# EAGLE design CBAM3.5 (EAGLE 5.07)
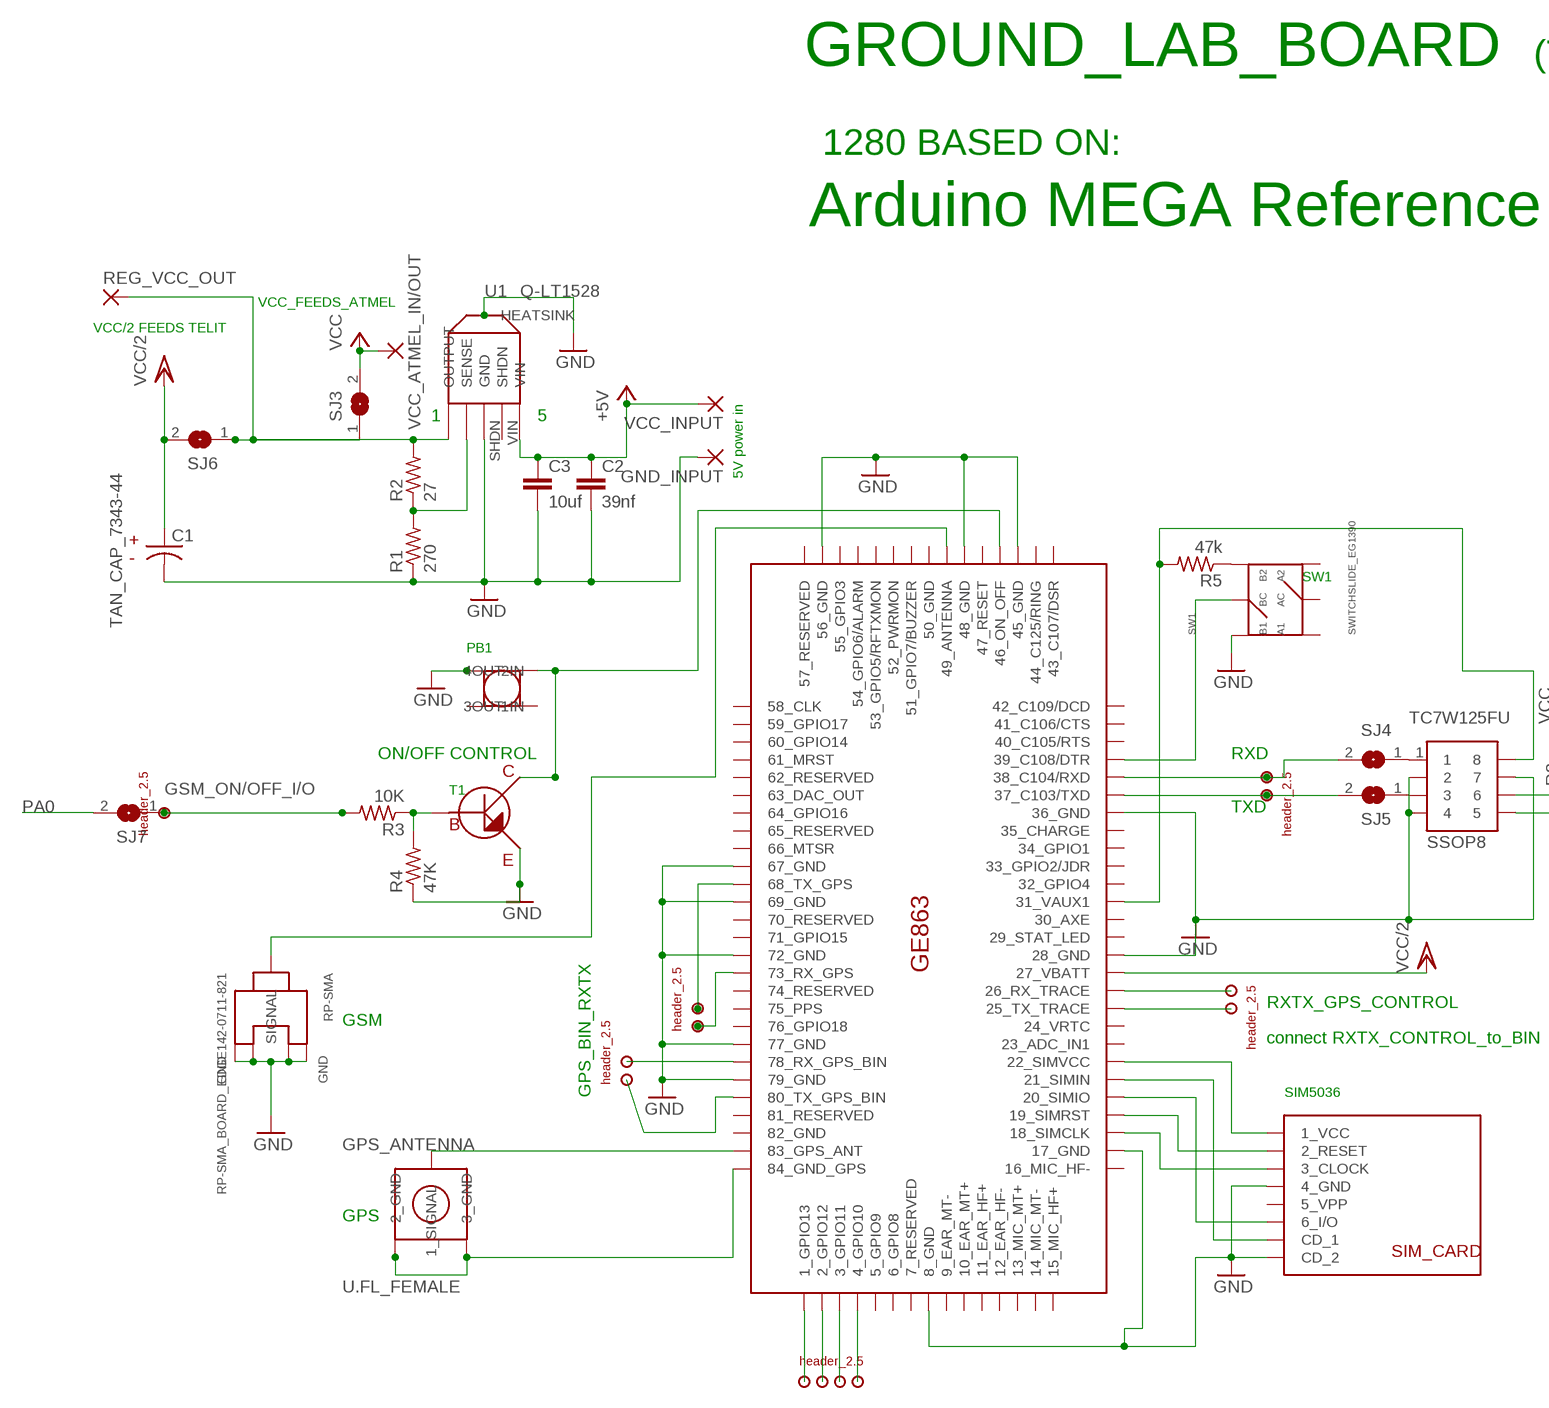
[diagram p0: schematic, sheet 1, part 1 of 2]
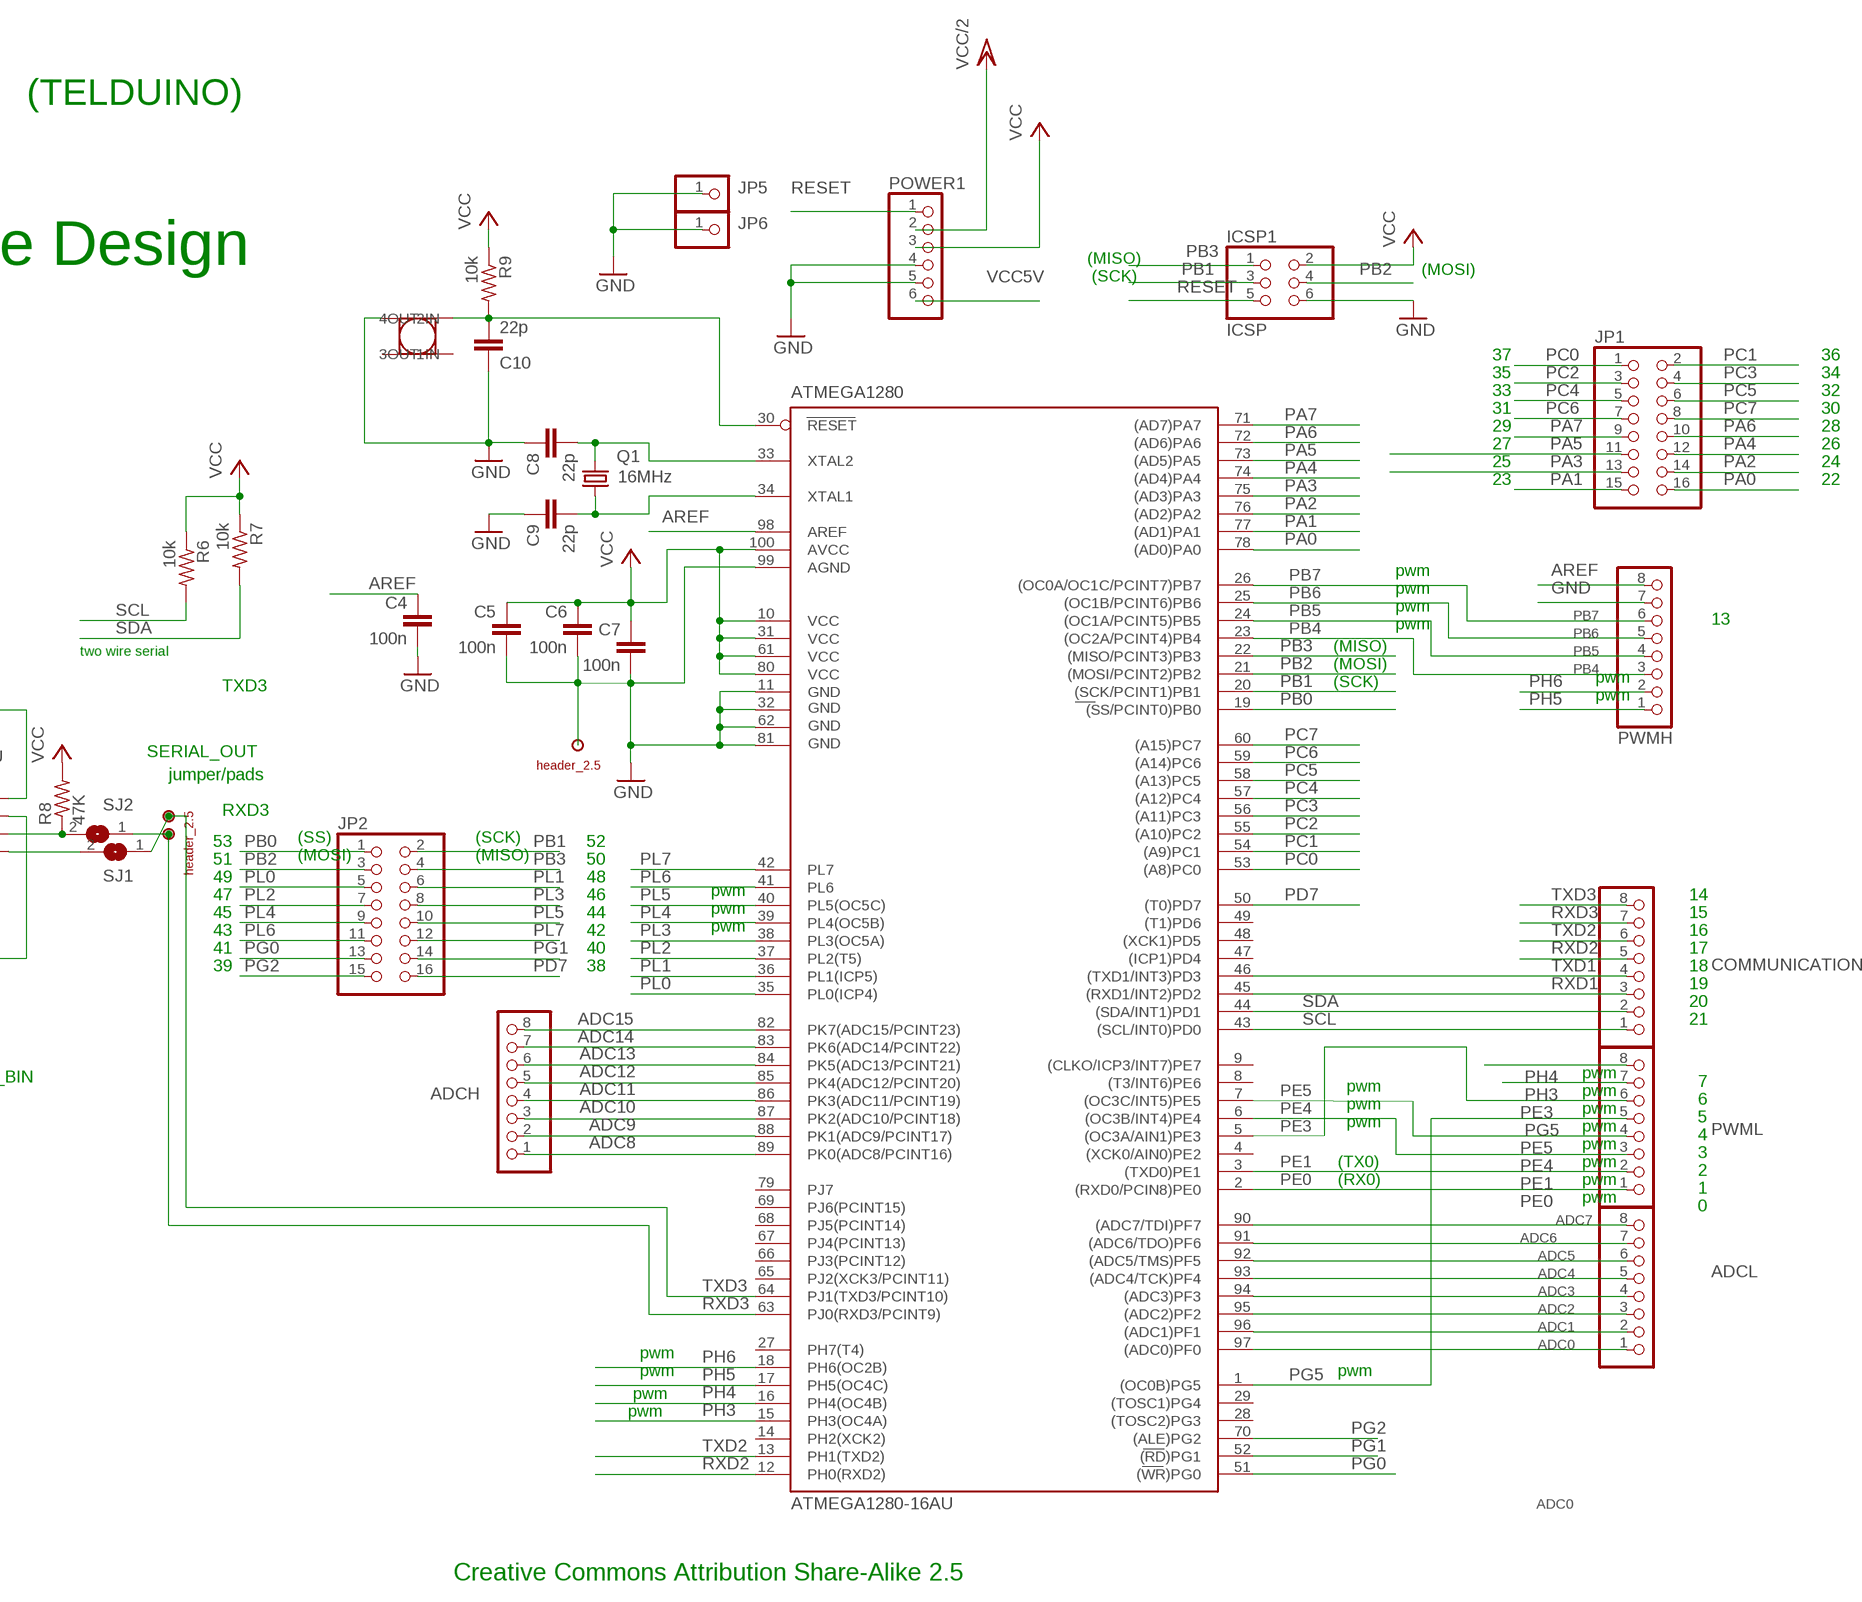
[diagram p1: schematic, sheet 1, part 2 of 2]

## Parts
ADCH  PINHD-1X8  [1X08]
ADCL  PINHD-1X8  [1X08]
AGND  2.5_1HEADER  [2.5_1HEADER]
ATMEGA1280  ATMEGA1280-16AU  [TQFP100]
C1  TAN_CAP_7343-44  [TAN_CAP_7343-44]
C2  39nf  C-EUC0805  [C0805]
C3  10uf  C-EUC1206  [C1206]
C4  100n  C-EUC0805  [C0805]
C5  100n  C-EUC0805  [C0805]
C6  100n  C-EUC0805  [C0805]
C7  100n  C-EUC0805  [C0805]
C8  22p  C-EUC0805  [C0805]
C9  22p  C-EUC0805  [C0805]
C10  22p  C-EUC0805  [C0805]
COMMUNICATION  PINHD-1X8  [1X08]
GE863  GE836  [GE836]
GND_INPUT  3,81/1,4  [3,81/1,4]
GPS_ANTENNA  U.FL_FEMALE  [U.FL_FEMALE]
ICSP1  ICSP  PINHD-2X3  [2X03]
JP1  PINHD-2X8  [2X08]
JP2  PINHD-2X8  [2X08]
JP5  PINHD-1X1  [1X01]
JP6  PINHD-1X1  [1X01]
POWER  SWITCHPB_KPT-1187B  [SWITCHPB_KPT-1187B]
POWER1  PINHD-1X6  [1X06]
POWER2  SWITCHPB_KPT-1187B  [SWITCHPB_KPT-1187B]
PWMH  PINHD-1X8  [1X08]
PWML  PINHD-1X8  [1X08]
Q1  16MHz  CRYTALHC49S  [HC49/S]
R1  270  R-US_0207/10  [0207/10]
R2  27  R-US_0207/10  [0207/10]
R3  10K  R-US_R1206  [R1206]
R4  47K  R-US_R1206  [R1206]
R5  47k  R-US_R1206  [R1206]
R6  10k  R-US_R1206  [R1206]
R7  10k  R-US_R1206  [R1206]
R8  47K  R-US_0207/10  [0207/10]
R9  10k  R-US_R1206  [R1206]
REG_VCC_OUT  3,81/1,4  [3,81/1,4]
RP-SMA  RP-SMA_BOARD_EDGE142-0711-821  [RP-SMA_SMALL]
RX/TX_ATMEL  2.5_2HEADER  [2.5_2HEADER]
RX/TX_GPS  2.5_2HEADER  [2.5_2HEADER]
RX/TX_GPS_BIN  2.5_2HEADER  [2.5_2HEADER]
RX/TX_TELIT  2.5_2HEADER  [2.5_2HEADER]
RX/TX_TRACE  2.5_2HEADER  [2.5_2HEADER]
SIM5036  SIMCARD_5036  [SIMCARD_5036]
SJ1  SJ  [SJ]
SJ2  SJ  [SJ]
SJ3  SJW  [SJW]
SJ4  SJ  [SJ]
SJ5  SJ  [SJ]
SJ6  SJW  [SJW]
SJ7  SJ  [SJ]
SW1  SWITCHSLIDE_EG1390  [SWITCHSLIDE_EG1390]
T1  SOT-23_MMBT4403  [SOT-23_MMBT4403]
TC7W125FU  SSOP8  [SSOP8]
TELIT_I/O_PINS  2.5_4HEADER  [2.5_4HEADER]
TELIT_ON/OFF  2.5_1HEADER  [2.5_1HEADER]
U1  Q-LT1528  [Q-LT1528]
VCC_ATMEL_IN/OUT  3,81/1,4  [3,81/1,4]
VCC_INPUT  3,81/1,4  [3,81/1,4]

## Nets
1_GPIO: GE863.1_GPIO13 TELIT_I/O_PINS.P$1(H1)
2_GPIO: GE863.2_GPIO12 TELIT_I/O_PINS.P$2(H2)
3_GPIO: GE863.3_GPIO11 TELIT_I/O_PINS.P$3(H3)
4_GPIO: GE863.4_GPIO10 TELIT_I/O_PINS.P$4(H4)
25_TX_TRACE: GE863.25_TX_TRACE RX/TX_TRACE.P$2(H2)
26_RX_TRACE: GE863.26_RX_TRACE RX/TX_TRACE.P$1(H1)
31_VAUX: GE863.31_VAUX1 R5.2 TC7W125FU.8
68_TXGPS: GE863.68_TX_GPS RX/TX_GPS.P$2(H2)
73_RXGPS: GE863.73_RX_GPS RX/TX_GPS.P$1(H1)
78_RX_GPS_BIN: GE863.78_RX_GPS_BIN RX/TX_GPS_BIN.P$2(H2)
80_TX_GPS_BIN: GE863.80_TX_GPS_BIN RX/TX_GPS_BIN.P$1(H1)
83_GPS_ANT: GE863.83_GPS_ANT GPS_ANTENNA.SIGNAL(1_SIGNAL)
84_GND_GPS: GE863.84_GND_GPS GPS_ANTENNA.GND1(2_GND) GPS_ANTENNA.GND2(3_GND)
ADC0: ADCL.1 ATMEGA1280.97((ADC0)PF0)
ADC1: ADCL.2 ATMEGA1280.96((ADC1)PF1)
ADC2: ADCL.3 ATMEGA1280.95((ADC2)PF2)
ADC3: ADCL.4 ATMEGA1280.94((ADC3)PF3)
ADC4: ADCL.5 ATMEGA1280.93((ADC4/TCK)PF4)
ADC5: ADCL.6 ATMEGA1280.92((ADC5/TMS)PF5)
ADC6: ADCL.7 ATMEGA1280.91((ADC6/TDO)PF6)
ADC7: ADCL.8 ATMEGA1280.90((ADC7/TDI)PF7)
ADC8: ADCH.1 ATMEGA1280.89(PK0(ADC8/PCINT16))
ADC9: ADCH.2 ATMEGA1280.88(PK1(ADC9/PCINT17))
ADC10: ADCH.3 ATMEGA1280.87(PK2(ADC10/PCINT18))
ADC11: ADCH.4 ATMEGA1280.86(PK3(ADC11/PCINT19))
ADC12: ADCH.5 ATMEGA1280.85(PK4(ADC12/PCINT20))
ADC13: ADCH.6 ATMEGA1280.84(PK5(ADC13/PCINT21))
ADC14: ADCH.7 ATMEGA1280.83(PK6(ADC14/PCINT22))
ADC15: ADCH.8 ATMEGA1280.82(PK7(ADC15/PCINT23))
AREF: ATMEGA1280.98(AREF) C4.1 PWMH.8
DTR: GE863.39_C108/DTR SW1.BCOM
GND [gnd]: AGND.P$1(H1) ATMEGA1280.11(GND) ATMEGA1280.32(GND1) ATMEGA1280.62(GND2) ATMEGA1280.81(GND3) ATMEGA1280.99(AGND) C1.NEG C2.2 C3.2 C4.2 C5.2 C6.2 C7.2 C8.1 C9.1 C10.1 GE863.8_GND GE863.17_GND GE863.28_GND GE863.36_GND GE863.45_GND GE863.48_GND GE863.56_GND GE863.67_GND GE863.69_GND GE863.72_GND GE863.77_GND GE863.79_GND GND_INPUT.1(P) ICSP1.6 JP5.1 JP6.1 POWER1.4 POWER1.5 POWER2.2IN POWER.2IN PWMH.7 R1.1 R4.1 RP-SMA.P$1(1GND) RP-SMA.P$2(2GND) RP-SMA.P$3(3GND) RP-SMA.P$4(4GND) SIM5036.4_GND SIM5036.CD_2 SW1.B1 T1.E TC7W125FU.2 TC7W125FU.4 TC7W125FU.7 U1.GND U1.HEATSINK
GSM_ON/OFF_I/O: R3.2 SJ7.1 TELIT_ON/OFF.P$1(H1)
N$1: R8.1 SJ2.2 TC7W125FU.6
N$2 [aSignal]: GE863.49_ANTENNA RP-SMA.SIGNAL
N$3: SJ5.1 TC7W125FU.3
N$4: R5.1 SW1.B2
N$5: SJ4.1 TC7W125FU.1
N$6: ATMEGA1280.34(XTAL1) C9.2 Q1.1
N$7: ATMEGA1280.33(XTAL2) C8.2 Q1.2
N$53: R3.1 R4.2 T1.B
ON/OFF: GE863.46_ON_OFF POWER.4OUT T1.C
PA0: ATMEGA1280.78((AD0)PA0) JP1.16 SJ7.2
PA1: ATMEGA1280.77((AD1)PA1) JP1.15
PA2: ATMEGA1280.76((AD2)PA2) JP1.14
PA3: ATMEGA1280.75((AD3)PA3) JP1.13
PA4: ATMEGA1280.74((AD4)PA4) JP1.12
PA5: ATMEGA1280.73((AD5)PA5) JP1.11
PA6: ATMEGA1280.72((AD6)PA6) JP1.10
PA7: ATMEGA1280.71((AD7)PA7) JP1.9
PB0: ATMEGA1280.19((SS/PCINT0)PB0) JP2.1
PB1: ATMEGA1280.20((SCK/PCINT1)PB1) ICSP1.3 JP2.2
PB2: ATMEGA1280.21((MOSI/PCINT2)PB2) ICSP1.4 JP2.3
PB3: ATMEGA1280.22((MISO/PCINT3)PB3) ICSP1.1 JP2.4
PB4: ATMEGA1280.23((OC2A/PCINT4)PB4) PWMH.3
PB5: ATMEGA1280.24((OC1A/PCINT5)PB5) PWMH.4
PB6: ATMEGA1280.25((OC1B/PCINT6)PB6) PWMH.5
PB7: ATMEGA1280.26((OC0A/OC1C/PCINT7)PB7) PWMH.6
PC0: ATMEGA1280.53((A8)PC0) JP1.1
PC1: ATMEGA1280.54((A9)PC1) JP1.2
PC2: ATMEGA1280.55((A10)PC2) JP1.3
PC3: ATMEGA1280.56((A11)PC3) JP1.4
PC4: ATMEGA1280.57((A12)PC4) JP1.5
PC5: ATMEGA1280.58((A13)PC5) JP1.6
PC6: ATMEGA1280.59((A14)PC6) JP1.7
PC7: ATMEGA1280.60((A15)PC7) JP1.8
PD7: ATMEGA1280.50((T0)PD7) JP2.16
PE0: ATMEGA1280.2((RXD0/PCIN8)PE0) PWML.1
PE1: ATMEGA1280.3((TXD0)PE1) PWML.2
PE3: ATMEGA1280.5((OC3A/AIN1)PE3) PWML.6
PE4: ATMEGA1280.6((OC3B/INT4)PE4) PWML.3
PE5: ATMEGA1280.7((OC3C/INT5)PE5) PWML.4
PG0: ATMEGA1280.51((WR)PG0) JP2.13
PG1: ATMEGA1280.52((RD)PG1) JP2.14
PG2: ATMEGA1280.70((ALE)PG2) JP2.15
PG5: ATMEGA1280.1((OC0B)PG5) PWML.5
PH3: ATMEGA1280.15(PH3(OC4A)) PWML.7
PH4: ATMEGA1280.16(PH4(OC4B)) PWML.8
PH5: ATMEGA1280.17(PH5(OC4C)) PWMH.1
PH6: ATMEGA1280.18(PH6(OC2B)) PWMH.2
PL0: ATMEGA1280.35(PL0(ICP4)) JP2.5
PL1: ATMEGA1280.36(PL1(ICP5)) JP2.6
PL2: ATMEGA1280.37(PL2(T5)) JP2.7
PL3: ATMEGA1280.38(PL3(OC5A)) JP2.8
PL4: ATMEGA1280.39(PL4(OC5B)) JP2.9
PL5: ATMEGA1280.40(PL5(OC5C)) JP2.10
PL6: ATMEGA1280.41(PL6) JP2.11
PL7: ATMEGA1280.42(PL7) JP2.12
REG_OUTPUT [power]: R2.2 REG_VCC_OUT.1(P) SJ3.1 SJ6.1 U1.OUTPUT
RESET: ATMEGA1280.30(RESET) C10.2 ICSP1.5 POWER1.1 POWER2.4OUT R9.2
RXD: GE863.38_C104/RXD RX/TX_TELIT.P$1(H1) SJ4.2
RXD1: ATMEGA1280.45((RXD1/INT2)PD2) COMMUNICATION.3
RXD2: ATMEGA1280.12(PH0(RXD2)) COMMUNICATION.5
RXD3: ATMEGA1280.63(PJ0(RXD3/PCINT9)) COMMUNICATION.7 RX/TX_ATMEL.P$2(H2) SJ2.1
SCL: ATMEGA1280.43((SCL/INT0)PD0) COMMUNICATION.1 R6.2
SDA: ATMEGA1280.44((SDA/INT1)PD1) COMMUNICATION.2 R7.2
SENCE: R1.2 R2.1 U1.SENCE(SENSE)
SIMCLOCK: GE863.18_SIMCLK SIM5036.3_CLOCK
SIMIN: GE863.21_SIMIN SIM5036.CD_1
SIMIO: GE863.20_SIMIO SIM5036.6_I/O
SIMRESET: GE863.19_SIMRST SIM5036.2_RESET
SIMVCC: GE863.22_SIMVCC SIM5036.1_VCC
TXD: GE863.37_C103/TXD RX/TX_TELIT.P$2(H2) SJ5.2
TXD1: ATMEGA1280.46((TXD1/INT3)PD3) COMMUNICATION.4
TXD2: ATMEGA1280.13(PH1(TXD2)) COMMUNICATION.6
TXD3: ATMEGA1280.64(PJ1(TXD3/PCINT10)) COMMUNICATION.8 RX/TX_ATMEL.P$1(H1) SJ1.1
TXD_IN: SJ1.2 TC7W125FU.5
VCC [VCC]: ATMEGA1280.10(VCC) ATMEGA1280.31(VCC1) ATMEGA1280.61(VCC2) ATMEGA1280.80(VCC3) ATMEGA1280.100(AVCC) C5.1 C6.1 C7.1 ICSP1.2 POWER1.3 R6.1 R7.1 R8.2 R9.1 SJ3.2 VCC_ATMEL_IN/OUT.1(P)
VCC5V [power]: C2.1 C3.1 POWER1.6 U1.VIN VCC_INPUT.1(P) ; supply symbol labelled +5V
VCC/2 [power]: C1.POS GE863.27_VBATT POWER1.2 SJ6.2
Unconnected: ATMEGA1280.4((XCK0/AIN0)PE2) ATMEGA1280.8((T3/INT6)PE6) ATMEGA1280.9((CLKO/ICP3/INT7)PE7) ATMEGA1280.14(PH2(XCK2)) ATMEGA1280.27(PH7(T4)) ATMEGA1280.28((TOSC2)PG3) ATMEGA1280.29((TOSC1)PG4) ATMEGA1280.47((ICP1)PD4) ATMEGA1280.48((XCK1)PD5) ATMEGA1280.49((T1)PD6) ATMEGA1280.65(PJ2(XCK3/PCINT11)) ATMEGA1280.66(PJ3(PCINT12)) ATMEGA1280.67(PJ4(PCINT13)) ATMEGA1280.68(PJ5(PCINT14)) ATMEGA1280.69(PJ6(PCINT15)) ATMEGA1280.79(PJ7) GE863.5_GPIO9 GE863.6_GPIO8 GE863.7_RESERVED GE863.9_EAR_MT- GE863.10_EAR_MT+ GE863.11_EAR_HF+ GE863.12_EAR_HF- GE863.13_MIC_MT+ GE863.14_MIC_MT- GE863.15_MIC_HF+ GE863.16_MIC_HF- GE863.23_ADC_IN1 GE863.24_VRTC GE863.29_STAT_LED GE863.30_AXE GE863.32_GPIO4 GE863.33_GPIO2/JDR GE863.34_GPIO1 GE863.35_CHARGE GE863.40_C105/RTS GE863.41_C106/CTS GE863.42_C109/DCD GE863.43_C107/DSR GE863.44_C125/RING GE863.47_RESET GE863.50_GND GE863.51_GPIO7/BUZZER GE863.52_PWRMON GE863.53_GPIO5/RFTXMON GE863.54_GPIO6/ALARM GE863.55_GPIO3 GE863.57_RESERVED GE863.58_CLK GE863.59_GPIO17 GE863.60_GPIO14 GE863.61_MRST GE863.62_RESERVED GE863.63_DAC_OUT GE863.64_GPIO16 GE863.65_RESERVED GE863.66_MTSR GE863.70_RESERVED GE863.71_GPIO15 GE863.74_RESERVED GE863.75_PPS GE863.76_GPIO18 GE863.81_RESERVED GE863.82_GND POWER2.1IN POWER2.3OUT POWER.1IN POWER.3OUT SIM5036.5_VPP SW1.A1 SW1.A2 SW1.ACOM U1.SHDN

## Notes on the sheet
- GROUND_LAB_BOARD | (TELDUINO)
- 1280 BASED ON:
- Arduino MEGA Reference Design | (MISO)
- (MOSI)
- (SCK)
- VCC_FEEDS_ATMEL
- 37 | 36
- VCC/2 FEEDS TELIT
- 35 | 34
- 33 | 32
- 31 | 30
- 29 | 28
- 5V power in
- 27 | 26
- 1 | 5
- 25 | 24
- 23 | 22
- pwm
- pwm
- pwm
- SW1
- pwm | 13
- (MISO)
- two wire serial
- (MOSI)
- (SCK) | pwm
- PB1 | TXD3
- pwm
- SERIAL_OUT
- jumper/pads
- ON/OFF CONTROL | RXD
- RXD3
- T1
- 53 | (SS) | (SCK) | 52
- TXD
- 51 | (MOSI) | (MISO) | 50
- 49 | 48
- 47 | 46 | pwm | 14
- 45 | 44 | pwm | 15
- 43 | 42 | pwm | 16
- 41 | 40 | 17
- 39 | 38 | 18
- 19
- 20
- 21
- RXTX_GPS_CONTROL
- GSM
- connect RXTX_CONTROL_to_BIN | pwm
- pwm | 7
- pwm
- pwm | 6
- pwm
- pwm | 5
- GPS_BIN_RXTX | pwm
- SIM5036
- 4
- pwm
- 3
- (TX0) | pwm
- 2
- (RX0) | pwm
- 1
- pwm
- 0
- GPS
- pwm
- pwm | pwm
- pwm
- pwm
- Creative Commons Attribution Share-Alike 2.5

## Library data of the parts
ADCH ADCL COMMUNICATION PWMH PWML = pinhead:PINHD-1X8: PIN HEADER
AGND TELIT_ON/OFF = myHeaders:2.5_1HEADER
ATMEGA1280 = atmel-2005:ATMEGA*: MICROCONTROLLER 64/128/256 Kbytes FLASH 4 Kbytes EEPROM 8 Kbytes SRAM 86 General Purpose I/O pins 12-channels16-bit PWM 4 x Serial USARTs 16-channels 10-bit A/D
C1 = myLib:TAN_CAP_7343-44
C2-C10 = rcl:C-EU: CAPACITOR, European symbol
GE863 = myLib:GE836
GND_INPUT REG_VCC_OUT VCC_ATMEL_IN/OUT VCC_INPUT = wirepad:3,81/1,4: THROUGH-HOLE PAD
GPS_ANTENNA = myLib:U.FL_FEMALE: tyco electronics 1566230 UMCC Female
ICSP1 = pinhead:PINHD-2X3: PIN HEADER
JP1 JP2 = pinhead:PINHD-2X8: PIN HEADER
JP5 JP6 = pinhead:PINHD-1X1: PIN HEADER
POWER POWER2 = myLib:SWITCHPB_KPT-1187B
POWER1 = pinhead:PINHD-1X6: PIN HEADER
Q1 = crystal:CRYTAL: CRYSTAL
R1-R9 = rcl:R-US_: RESISTOR, American symbol
RP-SMA = myConnectors:RP-SMA_BOARD_EDGE: RP-SMA board edge male connector man part # 142-4701-801 or #132255RP
RX/TX_ATMEL RX/TX_GPS RX/TX_GPS_BIN RX/TX_TELIT RX/TX_TRACE = myHeaders:2.5_2HEADER
SIM5036 = myLib:SIMCARD_5036
SJ1-SJ7 = jumper:SJ: SMD solder JUMPER
SW1 = myLib:SWITCHSLIDE_EG1390
T1 = mytransistors:SOT-23_MMBT4403
TC7W125FU = myIC:SSOP8: ssop8 package
TELIT_I/O_PINS = myHeaders:2.5_4HEADER: 2.5mm header spacing 1mm holes
U1 = myPowerRegulators:Q-LT1528: Q package for the LT1528 power Regulator, the heatsink connects to GND

## Net classes
0 default: width 0.203 mm, drill 0.406 mm, clearance 0.203 mm
1 power: width 0.61 mm, drill 0.711 mm, clearance 0.203 mm
2 gnd: width 0.305 mm, drill 0.711 mm, clearance 0.203 mm
3 VCC: width 0.508 mm, drill 0.711 mm, clearance 0.203 mm
4 aSignal: width 0.305 mm, drill 0.711 mm, clearance 0.508 mm

## Board
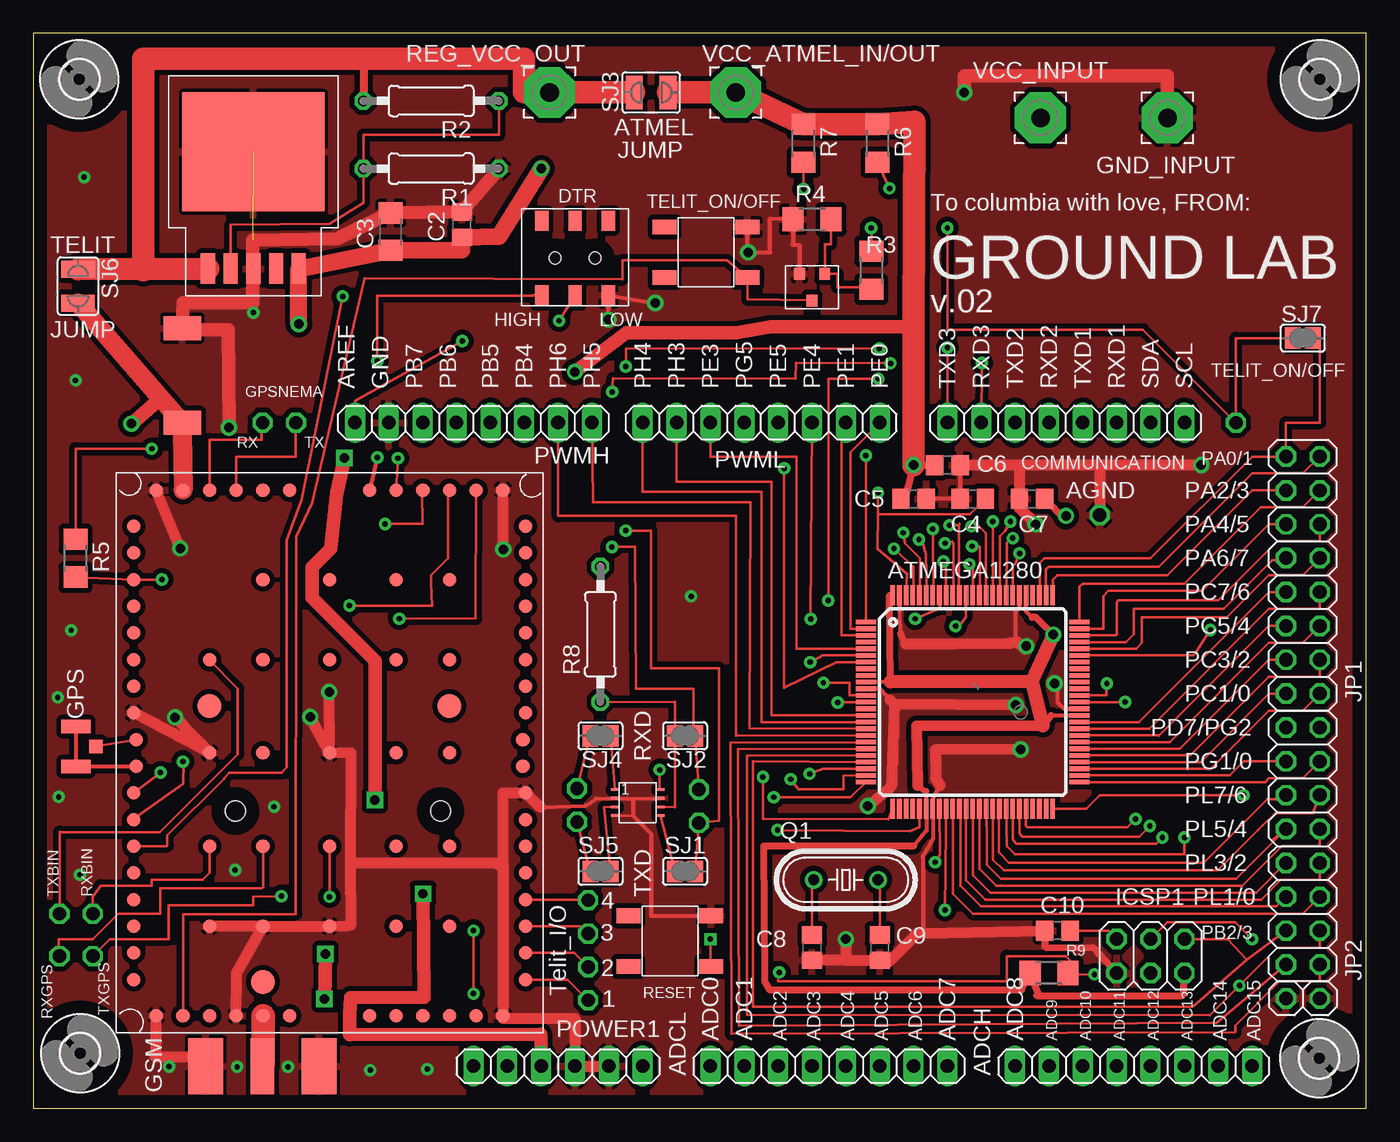
[diagram p2: board, top side]
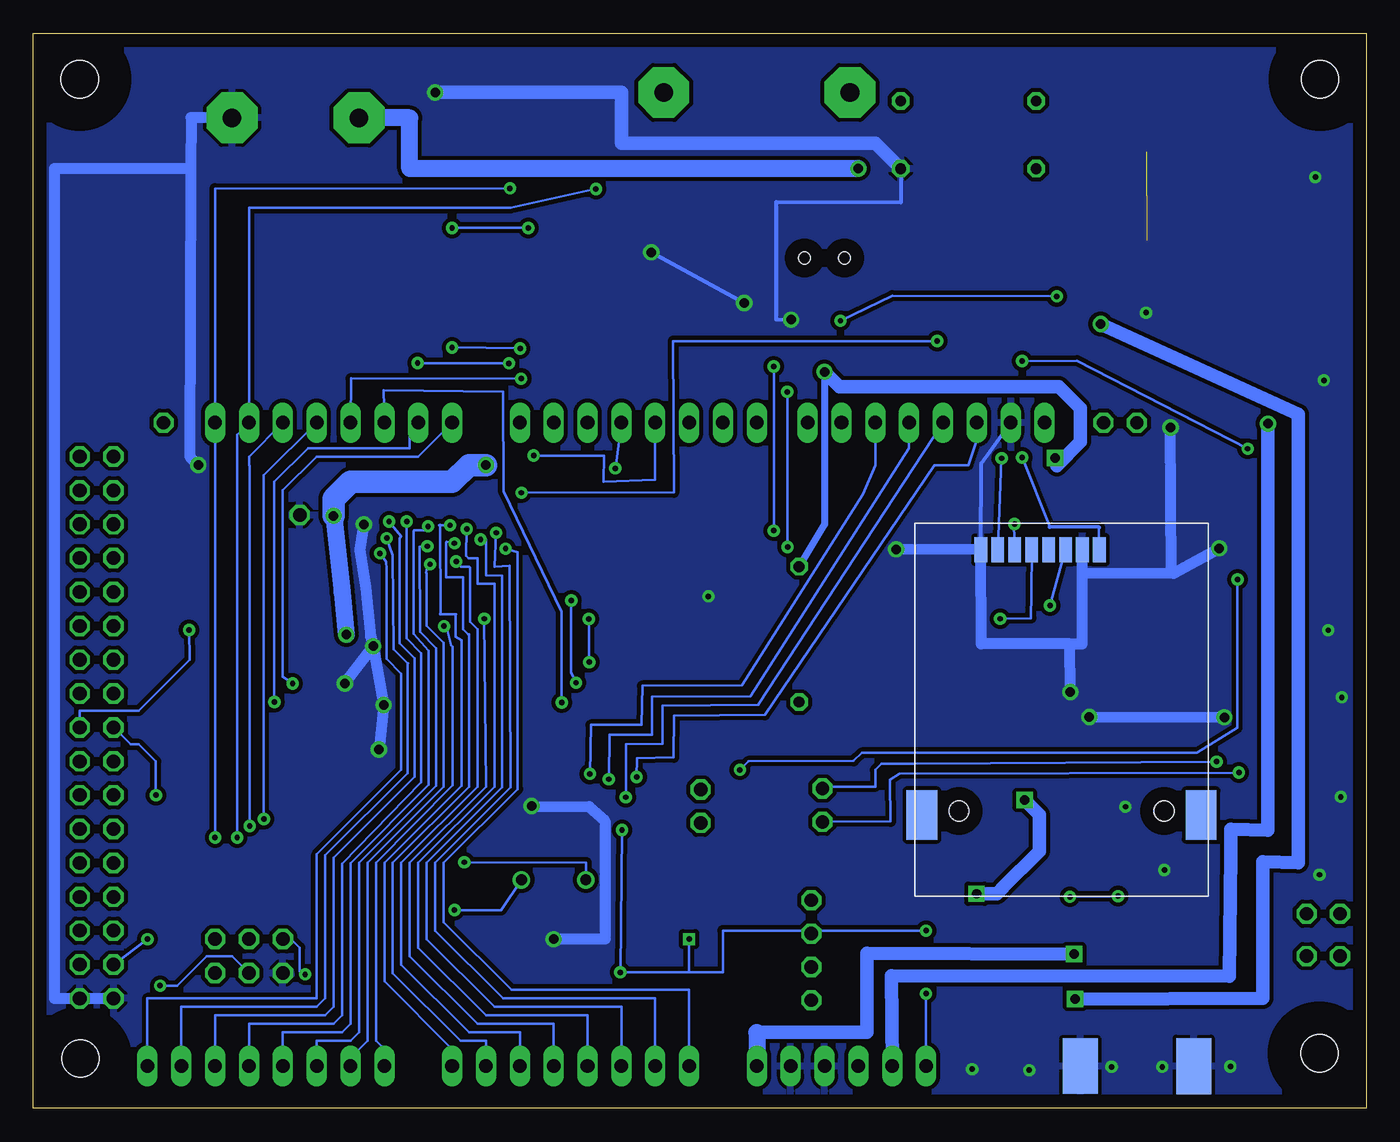
[diagram p3: board, bottom side, seen from below]

Size 100 x 80.64 mm. Coordinates in mm from the lower left corner, seen from the top.
Outline: 0,0 100,0 100,80.64 0,80.64 0,0
Copper layers (1*16): Top 0.035mm / dielectric 1.5mm / Bottom 0.035mm
Design rules "default *": minimum track width 8mil, minimum drill 16mil, track to track 8mil, track to pad 8mil, pad to pad 8mil, via to via 10mil, smd to smd 8mil, copper to edge 40mil, drill to drill 12mil, minimum pad ring 10mil, minimum via ring 10mil, stop-mask expansion 4mil, vias tented up to drill 28mil, thermal gap 10mil

### Footprints (pad centres in the part's own frame; a part is rotated, then mirrored left to right if it is on the bottom)
1X08 = drill 1.016 long: 1 -8.89,0; 2 -6.35,0; 3 -3.81,0; 4 -1.27,0; 5 1.27,0; 6 3.81,0; 7 6.35,0; 8 8.89,0
2.5_1HEADER = drill 1 octagon: P$1 0.06,0
TQFP100 = smd 1.5 x 0.35: 1 -8,6; 2 -8,5.5; 3 -8,5; 4 -8,4.5; 5 -8,4; 6 -8,3.5; 7 -8,3; 8 -8,2.5; 9 -8,2; 10 -8,1.5; 11 -8,1; 12 -8,0.5; 13 -8,0; 14 -8,-0.5; 15 -8,-1; 16 -8,-1.5; 17 -8,-2; 18 -8,-2.5; 19 -8,-3; 20 -8,-3.5; 21 -8,-4; 22 -8,-4.5; 23 -8,-5; 24 -8,-5.5; 25 -8,-6; 51 8,-6; 52 8,-5.5; 53 8,-5; 54 8,-4.5; 55 8,-4; 56 8,-3.5; 57 8,-3; 58 8,-2.5; 59 8,-2; 60 8,-1.5; 61 8,-1; 62 8,-0.5; 63 8,0; 64 8,0.5; 65 8,1; 66 8,1.5; 67 8,2; 68 8,2.5; 69 8,3; 70 8,3.5; 71 8,4; 72 8,4.5; 73 8,5; 74 8,5.5; 75 8,6 | smd 0.35 x 1.5: 26 -6,-8; 27 -5.5,-8; 28 -5,-8; 29 -4.5,-8; 30 -4,-8; 31 -3.5,-8; 32 -3,-8; 33 -2.5,-8; 34 -2,-8; 35 -1.5,-8; 36 -1,-8; 37 -0.5,-8; 38 0,-8; 39 0.5,-8; 40 1,-8; 41 1.5,-8; 42 2,-8; 43 2.5,-8; 44 3,-8; 45 3.5,-8; 46 4,-8; 47 4.5,-8; 48 5,-8; 49 5.5,-8; 50 6,-8; 76 6,8; 77 5.5,8; 78 5,8; 79 4.5,8; 80 4,8; 81 3.5,8; 82 3,8; 83 2.5,8; 84 2,8; 85 1.5,8; 86 1,8; 87 0.5,8; 88 0,8; 89 -0.5,8; 90 -1,8; 91 -1.5,8; 92 -2,8; 93 -2.5,8; 94 -3,8; 95 -3.5,8; 96 -4,8; 97 -4.5,8; 98 -5,8; 99 -5.5,8; 100 -6,8
TAN_CAP_7343-44 = smd 2.8 x 1.8: NEG 0,-3.5; POS 0,3.6
C0805 = smd 1.3 x 1.5: 1 -0.95,0; 2 0.95,0
C1206 = smd 1.6 x 1.8: 1 -1.4,0; 2 1.4,0
GE836 = smd 1 x 1: 1_GPIO13 -14.7,17; 2_GPIO12 -14.7,15; 3_GPIO11 -14.7,13; 4_GPIO10 -14.7,11; 5_GPIO9 -14.7,9; 6_GPIO8 -14.7,7; 7_RESERVED -14.7,5; 8_GND -14.7,3; 9_EAR_MT- -14.7,-3; 10_EAR_MT+ -14.7,-5; 11_EAR_HF+ -14.7,-7; 12_EAR_HF- -14.7,-9; 13_MIC_MT+ -14.7,-11; 14_MIC_MT- -14.7,-13; 15_MIC_HF+ -14.7,-15; 16_MIC_HF- -14.7,-17; 17_GND -13,-19.7; 18_SIMCLK -11,-19.7; 19_SIMRST -9,-19.7; 20_SIMIO -7,-19.7; 21_SIMIN -5,-19.7; 22_SIMVCC -3,-19.7; 23_ADC_IN1 3,-19.7; 24_VRTC 5,-19.7; 25_TX_TRACE 7,-19.7; 26_RX_TRACE 9,-19.7; 27_VBATT 11,-19.7; 28_GND 13,-19.7; 29_STAT_LED 14.7,-17; 30_AXE 14.7,-15; 31_VAUX1 14.7,-13; 32_GPIO4 14.7,-11; 33_GPIO2/JDR 14.7,-9; 34_GPIO1 14.7,-7; 35_CHARGE 14.7,-5; 36_GND 14.7,-3; 37_C103/TXD 14.7,3; 38_C104/RXD 14.7,5; 39_C108/DTR 14.7,7; 40_C105/RTS 14.7,9; 41_C106/CTS 14.7,11; 42_C109/DCD 14.7,13; 43_C107/DSR 14.7,15; 44_C125/RING 14.7,17; 45_GND 13,19.7; 46_ON_OFF 11,19.7; 47_RESET 9,19.7; 48_GND 7,19.7; 49_ANTENNA 5,19.7; 50_GND 3,19.7; 51_GPIO7/BUZZER -3,19.7; 52_PWRMON -5,19.7; 53_GPIO5/RFTXMON -7,19.7; 54_GPIO6/ALARM -9,19.7; 55_GPIO3 -11,19.7; 56_GND -13,19.7; 57_RESERVED -9,13; 58_CLK -9,7; 59_GPIO17 -9,0; 60_GPIO14 -9,-7; 61_MRST -9,-13; 62_RESERVED -5,13; 63_DAC_OUT -5,7; 64_GPIO16 -5,0; 65_RESERVED -5,-7; 66_MTSR -5,-13; 67_GND 0,13; 68_TX_GPS 0,7; 69_GND 0,0; 70_RESERVED 0,-7; 71_GPIO15 0,-13; 72_GND 5,13; 73_RX_GPS 5,7; 74_RESERVED 5,0; 75_PPS 5,-7; 76_GPIO18 5,-13; 77_GND 9,13; 78_RX_GPS_BIN 9,7; 79_GND 9,0; 80_TX_GPS_BIN 9,-7; 81_RESERVED -14.5,1; 82_GND -14.5,-1; 83_GPS_ANT 14.5,-1; 84_GND_GPS 14.5,1 | smd 1.8 x 1.8: P$85 5,17.2; P$86 9,-3.5; P$87 -9,-3.5
3,81/1,4 = drill 1.397 pad 3.81 octagon: 1 0,0
U.FL_FEMALE = smd 1 x 2.2: GND1 -1.5,0; GND2 1.5,0 | smd 1 x 1: SIGNAL 0,1.5
2X03 = drill 1.016 octagon: 1 -2.54,-1.27; 2 -2.54,1.27; 3 0,-1.27; 4 0,1.27; 5 2.54,-1.27; 6 2.54,1.27
2X08 = drill 1.016 octagon: 1 -8.89,-1.27; 2 -8.89,1.27; 3 -6.35,-1.27; 4 -6.35,1.27; 5 -3.81,-1.27; 6 -3.81,1.27; 7 -1.27,-1.27; 8 -1.27,1.27; 9 1.27,-1.27; 10 1.27,1.27; 11 3.81,-1.27; 12 3.81,1.27; 13 6.35,-1.27; 14 6.35,1.27; 15 8.89,-1.27; 16 8.89,1.27
1X01 = drill 1.016 octagon: 1 0,0
SWITCHPB_KPT-1187B = smd 1.8 x 1.1: 1IN -3.1,1.9; 2IN 3.1,1.9; 3OUT -3.1,-1.9; 4OUT 3.1,-1.9
1X06 = drill 1.016 long: 1 -6.35,0; 2 -3.81,0; 3 -1.27,0; 4 1.27,0; 5 3.81,0; 6 6.35,0
HC49/S = drill 0.813 round: 1 -2.413,0; 2 2.413,0
0207/10@1 = drill 0.813 octagon: 1 -5.08,0; 2 5.08,0
R1206@1 = smd 1.6 x 1.803: 1 -1.422,0; 2 1.422,0
R1206 = smd 1.6 x 1.803: 1 -1.422,0; 2 1.422,0
RP-SMA_SMALL = smd 2.616 x 4.191: P$1 -4.255,2.413; P$2 4.255,2.413 | smd 2.616 x 4.191 bottom: P$3 -4.255,2.413 | smd 2.616 x 4.166 bottom: P$4 4.255,2.413 | smd 1.778 x 4.191: SIGNAL 0,2.413
2.5_2HEADER = drill 1 octagon: P$1 -2.48,0; P$2 0.02,0
SIMCARD_5036 = smd 1.9 x 0.95: 1_VCC 0,2.84; 2_RESET 0,0.3; 3_CLOCK 0,-2.24; 4_GND 0,1.57; 5_VPP 0,-0.97; 6_I/O 0,-3.51; CD_1 0,-4.78; CD_2 0,-6.05 | smd 3.7 x 2.3: P$9 19.9,-10.47; P$10 19.9,10.47 | hole 1.5: 19.6,-7.7; 19.6,7.7
SJ = smd 1.168 x 1.6: 1 -0.762,0; 2 0.762,0
SJW = smd 1.27 x 2.54: 1 -1.27,0; 2 1.27,0
SWITCHSLIDE_EG1390 = smd 1 x 1.5: A1 -2.5,-5.6; A2 2.5,-5.6; ACOM 0,-5.6; B1 -2.5,0; B2 2.5,0; BCOM 0,0 | hole 0.889: -1.5,-2.8; 1.5,-2.8
SOT-23_MMBT4403 = smd 0.8 x 0.9: B -0.95,-1; C 0,1; E 0.94,-1
SSOP8 = smd 0.6 x 0.2: 1 -1.7,0.975; 2 -1.7,0.325; 3 -1.7,-0.325; 4 -1.7,-0.975; 5 1.7,-0.975; 6 1.7,-0.325; 7 1.71,0.325; 8 1.7,0.975
2.5_4HEADER = drill 1 octagon: P$1 -3.75,0; P$2 -1.25,0; P$3 1.25,0; P$4 3.75,0
Q-LT1528 = smd 1.067 x 2.286: GND 0,-4.318; OUTPUT -3.404,-4.318; SENCE -1.702,-4.318; SHDN 1.702,-4.318; VIN 3.404,-4.318 | smd 10.668 x 8.89: HEATSINK 0,4.445
2,8 = hole 2.8: 0,0

### Placement (x,y rotation side)
ADCH  82.55,3.17 0 top
ADCL  59.69,3.17 0 top
AGND  80.01,44.45 90 top
ATMEGA1280  70.48,30.48 0 top
C1  11.18,55.02 180 top
C2  32.16,66.29 90 top
C3  26.82,65.76 90 top
C4  70.48,45.72 180 top
C5  66.04,45.72 0 top
C6  68.58,48.26 0 top
C7  74.93,45.72 180 top
C8  58.42,12.06 90 top
C9  63.5,12.06 90 top
C10  76.83,13.33 0 top
COMMUNICATION  77.47,51.43 180 top
GE863  22.23,26.67 180 top
GND_INPUT  85.09,74.3 270 top
GPS_ANTENNA  3.2,27.15 270 top
ICSP1  83.82,11.43 180 top
JP1  95.25,40 90 top
JP2  95.25,19.69 90 top
JP5  96.52,8.26 0 top
JP6  93.98,8.26 0 top
POWER  50.47,64.21 0 top
POWER1  39.37,3.17 0 top
POWER2  47.75,12.55 0 top
PWMH  33.02,51.43 180 top
PWML  54.61,51.43 180 top
Q1  60.96,17.15 180 top
R1  270  [0207/10@1]  29.84,70.48 180 top
R2  27  [0207/10@1]  29.84,75.57 180 top
R3  10K  [R1206@1]  62.87,62.86 90 top
R4  47K  [R1206@1]  58.42,66.68 0 top
R5  47k  [R1206@1]  3.17,41.27 270 top
R6  10k  [R1206@1]  63.35,72.39 270 top
R7  10k  [R1206@1]  57.78,72.39 270 top
R8  47K  [0207/10@1]  42.55,35.56 90 top
R9  76.2,10.16 0 top
REG_VCC_OUT  38.73,76.2 0 top
RP-SMA  17.2,0.76 0 top
RX/TX_ATMEL  49.94,23.9 90 top
RX/TX_GPS  4.45,11.43 0 top
RX/TX_GPS_BIN  4.45,14.61 0 top
RX/TX_TELIT  40.79,21.51 270 top
RX/TX_TRACE  19.68,51.43 0 top
SIM5036  22.86,41.91 270 bottom
SJ1  48.9,17.78 180 top
SJ2  48.9,27.94 180 top
SJ3  46.35,76.2 0 top
SJ4  42.55,27.94 180 top
SJ5  42.55,17.78 180 top
SJ6  3.35,61.67 270 top
SJ7  95.25,57.78 0 top
SW1  40.64,60.99 180 top
T1  58.42,61.59 180 top
TC7W125FU  45.34,22.94 0 top
TELIT_I/O_PINS  41.63,11.86 90 top
TELIT_ON/OFF  90.17,51.43 0 top
U1  16.51,67.31 0 top
U$1  [2,8]  96.47,3.76 0 top
U$2  [2,8]  3.51,4.14 0 top
U$3  [2,8]  3.45,77.19 0 top
U$4  [2,8]  96.52,77.19 0 top
VCC_ATMEL_IN/OUT  52.7,76.2 0 top
VCC_INPUT  75.56,74.3 270 top

### Tracks (layer width: path | path; a pad name or v marks a point on that pad's centre or on a via)
1_GPIO
  Top 0.203: GE863.1_GPIO13 40.07,9.67 TELIT_I/O_PINS.P$1
2_GPIO
  Top 0.203: GE863.2_GPIO12 40.57,11.67 TELIT_I/O_PINS.P$2
3_GPIO
  Top 0.203: GE863.3_GPIO11 41.07,13.67 TELIT_I/O_PINS.P$3
4_GPIO
  Top 0.203: GE863.4_GPIO10 41.57,15.67 TELIT_I/O_PINS.P$4
25_TX_TRACE
  Top 0.203: RX/TX_TRACE.P$2 19.68,51.43 19.68,48.89 15.22,48.89 GE863.25_TX_TRACE
26_RX_TRACE
  Top 0.203: RX/TX_TRACE.P$1 17.14,51.43 17.14,50.16 13.23,50.16 13.23,49.76 13.22,49.76 GE863.26_RX_TRACE
31_VAUX  (via drill 0.41)
  Top 0.203: R5.2 GE863.31_VAUX1 9.22,39.67 v9.65,39.67 | TC7W125FU.8 46.99,23.96 v46.99,25.4
  Bottom 0.203: v46.99,25.4 46.35,26.04 38.46,26.06 37.85,26.67 12.7,26.67 9.68,28.55 v9.65,39.67
68_TXGPS  (via drill 0.41)
  Top 0.203: v22.23,15.88 GE863.68_TX_GPS | v18.62,15.93 16.51,15.88 16.51,15.24 10.16,15.24 10.16,12.7 5.74,12.7 RX/TX_GPS.P$2
  Bottom 0.203: v18.62,15.93 v22.23,15.88
73_RXGPS
  Top 0.203: GE863.73_RX_GPS 17.23,16.59 17.14,16.51 9.53,16.51 9.53,14.61 6.35,14.61 4.45,12.7 1.91,12.7 1.91,11.49 RX/TX_GPS.P$1
78_RX_GPS_BIN
  Top 0.203: GE863.78_RX_GPS_BIN 13.22,17.67 12.7,17.15 8.89,17.15 8.87,16.71 5.05,16.71 4.45,15.88 4.45,14.62 RX/TX_GPS_BIN.P$2
80_TX_GPS_BIN
  Top 0.203: GE863.80_TX_GPS_BIN 13.22,33.61 15.34,31.5 15.34,26.57 9.5,20.73 2.01,20.73 1.98,20.75 1.98,14.62 RX/TX_GPS_BIN.P$1
83_GPS_ANT
  Top 0.203: GPS_ANTENNA.SIGNAL GE863.83_GPS_ANT
84_GND_GPS
  Top 0.203: 7.71,25.65 GE863.84_GND_GPS
  Top 0.305: 7.71,25.65 GPS_ANTENNA.GND2 GPS_ANTENNA.GND1
ADC0  (via drill 0.41)
  Top 0.203: ATMEGA1280.97 66.04,38.53 66.04,40.64 v64.57,41.99
  Bottom 0.203: ADCL.1 50.8,8.89 64.14,8.89 69.22,13.97 69.22,18.42 63.65,23.95 63.65,41.73 v64.57,41.99
ADC1  (via drill 0.41)
  Top 0.203: ATMEGA1280.96 66.52,38.52 66.52,41.27 65.41,42.39 v65.28,43.18
  Bottom 0.203: ADCL.2 53.34,8.26 64.77,8.26 69.85,13.33 69.85,18.42 64.21,24.11 64.26,40.72 65.41,40.64 v65.28,43.18
ADC2  (via drill 0.41)
  Top 0.203: ATMEGA1280.95 67.03,38.53 66.98,41.58 66.73,42.37 v66.45,42.67
  Bottom 0.203: ADCL.3 55.88,7.62 65.41,7.62 70.48,12.7 70.48,18.42 64.85,24.08 64.85,39.95 66.04,40 66.04,42.67 v66.45,42.67
ADC3  (via drill 0.41)
  Top 0.203: ATMEGA1280.94 67.54,38.53 v67.49,43.46
  Bottom 0.203: v67.49,43.46 67.54,41.45 67.36,41.27 66.67,41.27 66.67,39.37 65.41,39.37 65.41,24.13 71.12,18.42 71.12,12.06 66.04,6.98 58.42,6.98 ADCL.4
ADC4  (via drill 0.41)
  Top 0.203: ATMEGA1280.93 68.02,38.49 68.02,37.52 v66.17,36.73
  Bottom 0.203: v66.17,36.73 66.04,24.13 71.75,18.42 71.75,11.43 66.67,6.35 60.96,6.35 ADCL.5
ADC5  (via drill 0.41)
  Top 0.203: ATMEGA1280.92 68.48,38.55 68.48,40.61 68.28,40.95 v68.28,41.02
  Bottom 0.203: v68.28,41.02 67.92,40.64 67.31,40.64 67.23,40.56 67.23,36.5 66.67,35.94 66.67,24.13 72.39,18.42 72.39,10.79 67.31,5.71 63.5,5.71 ADCL.6
ADC6  (via drill 0.41)
  Top 0.203: ATMEGA1280.91 69.04,38.48 69.04,42.37 68.96,42.49 v68.4,42.39
  Bottom 0.203: ADCL.7 66.04,5.08 67.94,5.08 73.03,10.16 73.03,18.42 67.31,24.13 67.31,35.56 67.39,35.56 67.77,35.94 67.77,39.85 69.04,39.83 69.04,42.44 69.01,42.49 v68.4,42.39
ADC7  (via drill 0.41)
  Top 0.203: ATMEGA1280.90 69.44,38.62 69.44,43.74 | 69.44,43.74 69.49,43.87 | v68.73,43.74 69.44,43.74
  Bottom 0.203: v68.73,43.74 69.57,43.74 69.47,43.79 69.44,37.16 69.49,37.06 68.28,37.06 68.3,37.03 68.3,35.38 67.87,35.1 67.87,24.21 73.66,18.42 73.66,9.53 68.58,4.45 ADCL.8
ADC8  (via drill 0.41)
  Top 0.203: ATMEGA1280.89 69.98,38.46 69.98,36.85 69.47,36.22 v69.19,36.17
  Bottom 0.203: ADCH.1 73.66,4.45 74.3,5.08 74.3,18.42 68.53,24.23 68.53,34.65 68.66,34.75 68.96,35.94 v69.19,36.17
ADC9  (via drill 0.41)
  Top 0.203: ATMEGA1280.88 70.51,38.5 70.51,40.26 70.46,40.77 v70.23,40.82
  Bottom 0.203: v70.23,40.82 70.51,40.39 70.54,40.18 70.48,40.13 70.48,36.2 69.22,34.92 69.22,24.13 74.93,18.42 74.93,5.08 76.2,3.81 ADCH.2
ADC10  (via drill 0.41)
  Top 0.203: ATMEGA1280.87 71.02,38.52 71.02,42.14 70.87,42.11 v70.43,42.16
  Bottom 0.203: v70.43,42.16 71.02,42.14 70.97,35.76 69.77,34.52 69.77,24.21 75.56,18.42 75.56,5.71 76.2,5.08 78.74,5.08 ADCH.3
ADC11  (via drill 0.41)
  Top 0.203: ATMEGA1280.86 71.48,38.49 71.48,43.13 70.94,43.66 v70.38,43.66
  Bottom 0.203: v70.38,43.66 70.69,43.36 71.42,43.36 71.48,43.31 71.48,35.61 70.36,34.31 70.36,24.28 76.2,18.39 76.2,6.35 76.83,5.71 81.28,5.71 ADCH.4
ADC12  (via drill 0.41)
  Top 0.203: ATMEGA1280.85 v71.98,44.02
  Bottom 0.203: v71.98,44.02 71.98,35.25 70.89,34.14 70.89,24.46 76.83,18.34 76.83,6.98 77.47,6.35 83.82,6.35 ADCH.5
ADC13  (via drill 0.41)
  Top 0.203: ATMEGA1280.84 72.52,38.51 72.52,42.93 72.9,43.31 v73.3,44.02
  Bottom 0.203: v73.3,44.02 72.42,42.9 72.44,42.82 72.52,42.75 72.52,34.9 71.4,33.78 71.4,24.89 77.47,18.82 77.47,7.62 78.11,6.98 86.36,6.98 ADCH.6
ADC14  (via drill 0.41)
  Top 0.203: ATMEGA1280.83 73,38.49 73.05,42.42 73.48,42.85 v73.48,42.77
  Bottom 0.203: v73.48,42.77 73.03,41.5 72.97,34.44 71.91,33.38 71.88,33.38 71.93,33.32 71.93,25.15 78.11,18.97 78.11,8.26 78.74,7.62 88.9,7.62 ADCH.7
ADC15  (via drill 0.41)
  Top 0.203: ATMEGA1280.82 73.51,38.5 73.51,40.66 73.69,40.84 v73.99,41.63
  Bottom 0.203: v73.99,41.63 73.53,41.02 73.48,40.46 73.51,40.44 73.51,33.73 72.39,32.59 72.39,25.4 78.74,19.05 78.74,8.26 91.44,8.26 ADCH.8
AREF  (via drill 0.41)
  Top 0.203: ATMEGA1280.98 65.53,40.11 63.32,41.96 63.35,44.56 | v63.37,46.18 63.35,44.56 | v32.18,57.56 24.16,53.06 PWMH.8 | C4.1 70.28,44.58 63.35,44.56
  Bottom 0.203: v63.37,46.18 51.94,46.2 51.99,57.56 v32.18,57.56
DTR  (via drill 0.41)
  Top 0.203: v23.22,60.91 20.14,45.67 19,42.62 19.02,25.58 18.62,25.17 14.71,25.17 14.3,24.77 14.3,24.74 10.06,20.5 10.06,19.74 10.01,19.69 GE863.39_C108/DTR | v39.45,59.08 SW1.BCOM
  Bottom 0.203: v23.22,60.91 35.56,60.96 v39.45,59.08
GND  (via drill 0.41, 0.71)  (1 unrouted)
  Top 0.203: 44.99,21.97 TC7W125FU.4
  Top 0.305: C7.2 73.98,45.04 | 75.89,12.15 76,12.06 | C9.1 64.12,10.94 | 66.73,13.13 66.73,18.9 67.49,20.19 67.49,22.43 ATMEGA1280.32 67.46,22.56 67.54,23.44 68.05,24.21 | 73.98,48.26 C6.2 C4.2 C5.2 | 65.08,35.61 ATMEGA1280.99 | 73.28,34.87 73.03,34.87 | ATMEGA1280.11 63.5,31.47 64.62,30.33 | 38.02,22.61 41.45,22.71 42.22,23.24 TC7W125FU.2 44.55,23.24 | U1.GND 16.51,62.86 | 10.79,58.42 C1.NEG | v43.16,59.16 SW1.B1 v46.66,60.4 | 44.55,23.24 44.98,23.22 44.99,21.97 46.35,20.6 46.35,14.45 POWER2.2IN | 44.55,23.24 TC7W125FU.7 | 67.72,24.79 67.74,24.69 | 64.29,30.63 64.14,30.48 | T1.E | T1.E 57.48,64.77 56.97,64.77 56.97,64.82 57,64.82 R4.1 55.27,66.75 55.27,64.21 v53.65,64.21 53.57,64.21 POWER.2IN | 35.25,6.96 GE863.56_GND 35.24,6.76 | ATMEGA1280.62 77.33,29.98 76.83,30.48 76.83,31.67 v76.63,31.88 | ATMEGA1280.81 73.98,37.56 73.71,37.29 73.71,35.06 73.76,35.01 | 9.12,3.89 9.22,4.14 | 34.92,18.42 34.8,18.29 | 23.8,18.33 23.88,18.42 | GE863.48_GND 15.22,8.24 15.24,8.26 | v19.1,3.12 19.05,3.15 19.05,3.17
  Top 0.508: ICSP1.6 79.5,12.09 76,12.06 | C10.1 75.89,12.15 | 65.46,34.82 65.08,35.61
  Top 0.813: 73.98,45.04 v75.21,43.81 | C10.1 66.73,13.13 66.34,13.16 64.12,10.94 | 73.98,48.26 C7.2 | 65.46,34.82 69.09,34.82 73.03,34.87 | 73.28,34.87 73.76,35.01 74.4,34.47 v74.5,34.67 | v74.07,26.92 67.67,26.9 67.72,24.79 | v35.26,41.93 GE863.17_GND | GE863.48_GND 15.24,10.16 GE863.72_GND | GE863.72_GND GE863.77_GND | GE863.72_GND GE863.67_GND 23.49,13.69 23.82,13.77 23.8,18.33 23.82,26.65 GE863.69_GND | 80.01,48.26 C6.2 | v87.63,48.26 80.01,48.26 | v11.02,42.01 GE863.28_GND | 38.02,22.61 GE863.8_GND 35.23,23.67 35.23,18.47 35.18,18.42 34.92,18.42 23.88,18.42 | GE863.69_GND v20.78,29.36 | v10.64,29.34 GE863.79_GND GE863.36_GND | GE863.69_GND v22.2,31.24 | POWER1.5 POWER1.4 40.64,6.76 35.24,6.76 | 80.01,48.26 AGND.P$1 | 60.96,11.12 C9.1 | 60.96,11.12 C8.1 | 64.62,30.33 64.36,24.16 v62.61,22.68 | v60.96,12.7 60.96,11.12 | 67.74,24.69 68.05,24.21 | v73.71,30.25 64.62,30.33 | 64.62,30.33 64.29,30.63 | 35.25,6.96 35.26,18.34 34.8,18.29 | 9.22,4.14 GE863.45_GND | 9.12,3.89 12.38,3.89
  Top 1.016: R1.1 C2.2 C3.2 22.78,65.23 16.46,65.13 U1.GND 16.46,60.43 11.23,60.43 C1.NEG | 10.79,58.42 14.61,58.42 v14.68,51.08 | GND_INPUT.1 85.09,77.47 69.85,77.47 v69.85,76.2
  Bottom 0.305: 29.21,41.91 SIM5036.CD_2 28.88,48.36 PWMH.7 | SIM5036.4_GND 21.23,40.16 | v43.16,59.16 44.27,59.18 44.27,67.97 34.92,67.95 R1.1 | v46.66,60.4 v53.65,64.21 | 57.12,12.88 57.1,12.7 | 14.58,40.18 14.61,40.21
  Bottom 0.813: v74.5,34.67 v76.63,31.88 | v74.5,34.67 v73.71,30.25 v74.07,26.92 | 29.21,41.91 v35.26,41.93 | v87.63,48.26 88.27,48.89 88.18,70.48 | SIM5036.CD_2 28.88,34.85 22.23,34.85 | 22.23,34.85 21.31,34.85 SIM5036.4_GND | 21.23,40.16 14.58,40.18 14.45,40.13 v11.02,42.01 | v20.78,29.36 v10.64,29.34 | v22.2,31.24 22.23,34.85 | 88.18,70.48 88.16,74.32 GND_INPUT.1 | 88.18,70.48 98.42,70.48 98.42,8.26 JP5.1 JP6.1 | v75.21,43.81 75.51,41.91 75.06,39.04 74.7,35.38 v74.5,34.67 | v62.61,22.68 58.29,22.63 57.12,21.57 57.12,12.88 | 57.1,12.7 v60.96,12.7 | 14.61,40.21 v14.68,51.08
  Bottom 1.016: v69.85,76.2 55.88,76.2 55.88,72.39 36.83,72.39 R1.1
  other vias: 25.27,2.87 29.57,2.95 15.29,3.12 10.19,3.15 2.84,35.86 1.83,30.84 1.91,23.37 18.06,22.63 15.14,17.88 49.35,38.4 3.17,54.61 16.51,59.69 3.81,69.85 3.51,17.53
  pour Top (isolate 0.381): 0,80.42 99.8,80.52 99.69,0 0.36,0
  pour Bottom (isolate 0.305): 0.25,80.42 99.75,80.49 99.69,0.05 0.03,0
GSM_ON/OFF_I/O  (via drill 0.41)
  Top 0.203: 62.87,64.14 R3.2 v62.87,66.04 | v68.58,66.04 68.58,58.42 83.25,58.42 TELIT_ON/OFF.P$1 90.23,57.78 SJ7.1
  Bottom 0.203: v62.87,66.04 v68.58,66.04
N$1
  Top 0.203: TC7W125FU.6 48.13,22.61 SJ2.2 48.13,30.51 R8.1
N$2
  Top 0.305: 17.23,3.3 17.2,3.3 RP-SMA.SIGNAL
  Top 1.778: 17.23,3.3 GE863.49_ANTENNA
N$3
  Top 0.203: SJ5.1 42.82,22.61 TC7W125FU.3
N$4  (via drill 0.41)
  Top 0.203: R5.1 3.17,49.48 v8.89,49.48 | SW1.B2 37.47,60.98 37.47,60.96 25.81,60.96 v25.81,56.06
  Bottom 0.203: v25.81,56.06 21.69,56.08 v8.89,49.48
N$5
  Top 0.203: TC7W125FU.1 SJ4.1
N$6  (via drill 0.41)
  Top 0.203: ATMEGA1280.34 68.48,20.86 v68.4,14.88 | Q1.1 63.5,16.38 C9.2
  Bottom 0.203: v68.4,14.88 64.9,14.88 Q1.1
N$7  (via drill 0.41)
  Top 0.203: ATMEGA1280.33 68.01,19.04 v67.67,18.47 | Q1.2 58.42,16.38 C8.2
  Bottom 0.203: v67.67,18.47 58.52,18.44 Q1.2
N$53
  Top 0.203: R3.1 62.71,61.59 60.33,61.59 60.33,62.61 60.31,62.59 T1.B 59.41,62.59 59.41,64.82 59.84,64.82 59.84,64.85 | 59.84,64.85 | 59.84,64.85 R4.2
ON/OFF
  Top 0.203: GE863.46_ON_OFF 11.23,14.58 19.68,14.58 19.74,41.05 19.74,42.88 20.9,45.41 24.87,62.25 44.22,62.2 44.22,63.6 52.05,63.6 POWER.4OUT 53.59,62.31 53.59,60.68 T1.C
PA0
  Top 0.203: ATMEGA1280.78 75.51,38.51 75.51,40.92 75.87,41.27 83.82,41.27 91.44,48.89 JP1.16 93.98,51.43 96.52,51.43 96.52,57.78 SJ7.2
PA1
  Top 0.203: ATMEGA1280.77 75.98,40.42 76.2,40.64 84.45,40.64 91.44,47.62 95.25,47.62 JP1.15
PA2
  Top 0.203: ATMEGA1280.76 76.48,39.66 76.83,40 85.09,40 91.44,46.35 JP1.14
PA3
  Top 0.203: ATMEGA1280.75 78.48,39.11 78.74,39.37 86.36,39.37 92.08,45.09 95.25,45.09 JP1.13
PA4
  Top 0.203: ATMEGA1280.74 80.25,35.98 80.26,35.99 80.26,38.41 80.67,38.81 87.71,38.81 92.71,43.81 JP1.12
PA5
  Top 0.203: ATMEGA1280.73 81.2,35.48 81.28,35.56 81.28,37.97 81.41,38.1 88.9,38.1 93.34,42.54 96.52,42.54 JP1.11
PA6
  Top 0.203: ATMEGA1280.72 81.97,34.98 82.55,35.56 82.55,37.46 89.15,37.49 89.31,37.49 92.94,41.12 93.83,41.12 JP1.10
PA7
  Top 0.203: ATMEGA1280.71 82.74,34.48 83.19,34.92 83.19,36.83 89.53,36.83 92.71,40 95.25,40 JP1.9
PB0
  Top 0.203: ATMEGA1280.19 52.3,27.43 52.38,5.59 90.17,5.71 90.17,6.2 93.5,9.53 96.47,9.53 96.52,9.58 JP2.1
PB1  (via drill 0.41)
  Top 0.203: ATMEGA1280.20 52.88,26.92 52.93,6.2 88.8,6.43 JP2.2 | ICSP1.3 85.09,13.97 90.17,13.97 v91.44,12.7
  Bottom 0.203: JP2.2 v91.44,12.7
PB2  (via drill 0.41)
  Top 0.203: ATMEGA1280.21 53.54,26.47 53.54,7.04 88.27,6.98 v90.49,9.21 93.34,12.06 96.52,12.06 JP2.3
  Bottom 0.203: ICSP1.4 85.09,11.43 87,11.43 89.22,9.21 v90.49,9.21
PB3
  Top 0.203: ATMEGA1280.22 53.98,26.04 53.98,7.62 87,7.62 91.03,11.15 | 91.03,11.15 JP2.4 | ICSP1.1 89.63,12.7 91.03,11.15
PB4  (via drill 0.41)
  Top 0.203: ATMEGA1280.23 59.23,25.48 v58.24,25.1
  Bottom 0.203: v58.24,25.1 58.17,28.78 54.38,28.78 54.3,31.7 46.84,31.75 37.74,46.05 36.83,48.26 PWMH.3
PB5  (via drill 0.41)
  Top 0.203: ATMEGA1280.24 60.78,24.97 60.78,23.95 57.4,23.95 v56.82,24.69
  Bottom 0.203: v56.82,24.69 56.77,28.02 53.59,28.04 53.59,30.86 46.18,30.91 34.29,49.53 PWMH.4
PB6  (via drill 0.41)
  Top 0.203: ATMEGA1280.25 61.29,23.34 v55.55,23.34
  Bottom 0.203: v55.55,23.34 55.55,27.31 52.78,27.36 52.78,30.2 45.59,30.28 45.64,30.28 45.59,30.3 PWMH.5
PB7  (via drill 0.41)
  Top 0.203: ATMEGA1280.26 64.16,21.69 54.74,21.72 v54.74,24.87
  Bottom 0.203: v54.74,24.87 54.71,26.26 51.97,26.34 51.92,29.46 45.11,29.52 32.38,48.26 29.84,48.26 29.21,50.16 PWMH.6
PC0
  Top 0.203: ATMEGA1280.53 88.34,25.48 92.71,29.85 95.25,29.85 JP1.1
PC1
  Top 0.203: ATMEGA1280.54 87.58,25.98 92.71,31.12 JP1.2
PC2
  Top 0.203: ATMEGA1280.55 86.81,26.48 92.71,32.38 96.52,32.38 JP1.3
PC3
  Top 0.203: ATMEGA1280.56 86.03,26.98 92.71,33.66 JP1.4
PC4
  Top 0.203: ATMEGA1280.57 85.27,27.48 92.71,34.92 95.25,34.92 JP1.5
PC5
  Top 0.203: ATMEGA1280.58 84.42,27.98 84.45,27.94 92.71,36.2 JP1.6
PC6
  Top 0.203: ATMEGA1280.59 83.72,28.48 92.71,37.46 96.52,37.46 JP1.7
PC7
  Top 0.203: ATMEGA1280.60 82.95,28.98 92.71,38.73 JP1.8
PD7  (via drill 0.41)
  Top 0.203: ATMEGA1280.50 79,22.48 80.01,23.5 v90.81,23.5
  Bottom 0.203: v90.81,23.5 90.81,26.04 92.08,27.31 92.71,27.31 JP2.16
PE0
  Top 0.203: ATMEGA1280.2 61.29,35.97 61.32,49.2 PWML.1
PE1
  Top 0.203: ATMEGA1280.3 60.63,35.48 60.63,49.86 PWML.2
PE3
  Top 0.203: ATMEGA1280.5 57.25,34.49 57.25,48.89 50.8,48.89 PWML.6
PE4  (via drill 0.41)
  Top 0.203: ATMEGA1280.6 59.26,33.98 v58.29,33.48 | v58.32,36.7 PWML.3
  Bottom 0.203: v58.29,33.48 v58.32,36.7
PE5  (via drill 0.41)
  Top 0.203: ATMEGA1280.7 60.27,33.48 56.34,31.57 v56.34,48.01
  Bottom 0.203: v56.34,48.01 PWML.4
PG0
  Top 0.203: ATMEGA1280.51 92.42,24.48 92.71,24.77 95.25,24.77 JP2.13
PG1
  Top 0.203: ATMEGA1280.52 89.75,24.98 90.81,26.04 JP2.14
PG2  (via drill 0.41)
  Top 0.203: ATMEGA1280.70 87.02,33.98 87.17,34.14 87.2,34.14 v88.32,35.89
  Bottom 0.203: v88.32,35.89 88.27,33.66 92.08,29.85 96.52,29.85 JP2.15
PG5  (via drill 0.41)
  Top 0.203: ATMEGA1280.1 v62.46,48.97
  Bottom 0.203: v62.46,48.97 57.17,48.97 57.2,47.02 53.34,47.14 PWML.5
PH3
  Top 0.203: ATMEGA1280.15 55.4,29.49 55.4,47.02 48.26,47.02 PWML.7
PH4
  Top 0.203: ATMEGA1280.16 54.63,28.96 54.63,46.25 45.72,46.25 PWML.8
PH5
  Top 0.203: ATMEGA1280.17 53.72,28.5 53.8,45.47 41.99,45.47 PWMH.1
PH6
  Top 0.203: ATMEGA1280.18 52.7,27.94 52.7,44.45 39.37,44.45 PWMH.2
PL0
  Top 0.203: ATMEGA1280.35 68.98,16.11 70.48,14.61 95.25,14.61 JP2.5
PL1
  Top 0.203: ATMEGA1280.36 69.55,22.42 69.55,16.71 71.09,15.16 93.27,15.16 JP2.6
PL2
  Top 0.203: JP2.7 96.52,17.15 93.6,17.15 92.13,15.67 71.42,15.67 69.98,17.11 ATMEGA1280.37
PL3
  Top 0.203: ATMEGA1280.38 70.48,17.5 71.81,16.18 91.75,16.18 JP2.8
PL4
  Top 0.203: 96.52,19.86 96.52,19.69 | 96.52,19.86 JP2.9 | ATMEGA1280.39 70.98,17.97 72.24,16.71 90.7,16.71 93.67,19.69 96.34,19.69 96.52,19.86
PL5
  Top 0.203: ATMEGA1280.40 71.55,20.68 71.55,18.29 72.59,17.25 90.27,17.25 JP2.10 92.99,20.14
PL6
  Top 0.203: ATMEGA1280.41 72.01,20.88 72.01,18.67 72.82,17.86 88.86,17.86 92.25,21.25 | 92.25,21.25 91.9,20.9 | 92.25,21.25 93.17,22.15 96.01,22.15 JP2.11
PL7
  Top 0.203: ATMEGA1280.42 72.44,21.29 72.44,19.2 73.2,18.44 87.83,18.44 92.58,23.19 93.67,23.19 JP2.12
REG_OUTPUT
  Top 0.61: U1.OUTPUT 8.26,62.86 | 24.77,78.74 R2.2
  Top 1.676: SJ3.1 REG_VCC_OUT.1 36.83,76.2 36.83,78.74 24.77,78.74 8.26,78.74 8.26,62.86 | SJ6.1 U1.OUTPUT
RESET  (via drill 0.41)
  Top 0.203: v79.6,10.06 78.38,10.03 R9.2 78.26,10.64 77.47,11.43 73.03,11.43 73.03,9.53 55.88,9.53 v55.96,10.21 | ICSP1.5 80.64,13.33 C10.2 | ATMEGA1280.30 66.5,22.47 66.5,21.11 65.79,20.78 v55.83,20.88 | v33.02,8.61 v33.02,13.33 | POWER2.4OUT 50.8,10.65 v50.8,12.7
  Bottom 0.203: v79.6,10.06 80.01,10.29 80.01,12.06 80.64,12.7 ICSP1.5 | v55.83,20.88 v55.96,10.21 50.8,10.21 | 50.8,10.21 48.26,10.21 48.26,13.33 v33.02,13.33 | POWER1.1 v33.02,8.61 | 50.8,10.21 v50.8,12.7
RXD  (via drill 0.41)
  Top 0.203: RX/TX_TELIT.P$1 SJ4.2 | v11.23,26.01 11.28,26.01 11.25,24.36 7.53,21.72 GE863.38_C104/RXD
  Bottom 0.203: v11.23,26.01 33.86,25.86 36.37,25.86 36.83,25.4 36.83,24.13 40.66,24.13 RX/TX_TELIT.P$1
RXD1  (via drill 0.41)
  Top 0.203: ATMEGA1280.45 73.98,20.63 74.22,20.4 82.98,20.4 v83.77,21.18
  Bottom 0.203: v83.77,21.18 83.77,48.21 83.82,48.26 83.82,48.89 COMMUNICATION.3
RXD2  (via drill 0.41)
  Top 0.203: v59.64,38.1 59.66,54.74 v63.4,54.74 | ATMEGA1280.12 61.21,30.99 61.21,31.93 v59.28,31.93
  Bottom 0.203: v59.28,31.93 59.64,32.71 v59.64,38.1 | v63.4,54.74 76.17,54.76 COMMUNICATION.5
RXD3  (via drill 0.41)
  Top 0.203: v81.92,30.48 ATMEGA1280.63 | v43.41,42.11 45.16,42.14 45.21,31.5 49.53,31.5 49.53,27.31 SJ2.1 RX/TX_ATMEL.P$2 | v43.43,53.75 43.48,54.76 57.17,54.74 57.23,55.93 v64.31,55.88 | v71.17,55.91 COMMUNICATION.7
  Bottom 0.203: v81.92,30.48 81.92,46.99 79.38,49.53 71.75,49.53 71.75,50.8 COMMUNICATION.7 | v43.41,42.11 v43.43,53.75 | v64.31,55.88 v71.17,55.91
SCL  (via drill 0.41)
  Top 0.203: v64.24,69.01 R6.2 | ATMEGA1280.43 73.03,19.69 73.66,19.05 86.36,19.05 v86.36,20.32
  Bottom 0.203: v64.24,69.01 86.36,68.99 COMMUNICATION.1 v86.36,20.32
SDA  (via drill 0.41)
  Top 0.203: ATMEGA1280.44 73.48,20.14 73.76,19.86 84.25,19.86 v84.71,20.32 | 57.78,71.12 R7.2 v57.78,68.96
  Bottom 0.203: v84.71,20.32 84.71,50.55 COMMUNICATION.2 83.8,67.54 64.19,67.54 v57.78,68.96
SENCE
  Top 0.203: R2.1 34.92,73.03 24.77,73.03 R1.2 24.77,67.95 22.23,66.34 14.81,66.29 U1.SENCE
SIMCLOCK  (via drill 0.41)
  Top 0.203: v27.46,36.73 33.2,36.75 GE863.18_SIMCLK
  Bottom 0.203: SIM5036.3_CLOCK 25.12,38.61 25.15,36.78 v27.46,36.73
SIMIN  (via drill 0.41)
  Top 0.203: v27.36,48.77 GE863.21_SIMIN
  Bottom 0.203: SIM5036.CD_1 v27.36,48.77
SIMIO  (via drill 0.41)
  Top 0.203: v26.39,43.84 29.21,43.87 29.16,46.15 GE863.20_SIMIO
  Bottom 0.203: SIM5036.6_I/O 26.44,43.66 v26.39,43.84
SIMRESET  (via drill 0.41)
  Top 0.203: v23.72,37.72 29.92,37.72 29.84,39.37 29.84,40 31.11,41.27 31.11,46.35 GE863.19_SIMRST
  Bottom 0.203: v23.72,37.72 SIM5036.2_RESET
SIMVCC  (via drill 0.41)
  Top 0.305: v25.81,48.82 GE863.22_SIMVCC
  Bottom 0.203: 23.75,43.61 v25.81,48.82 | SIM5036.1_VCC 20.04,43.59
  Bottom 0.305: 20.04,43.59 23.75,43.61
TXD  (via drill 0.41)
  Top 0.203: RX/TX_TELIT.P$2 SJ5.2 | GE863.37_C103/TXD v9.55,25.2
  Bottom 0.203: v9.55,25.2 35,25.12 35.74,24.64 35.69,21.54 RX/TX_TELIT.P$2
TXD1  (via drill 0.41)
  Top 0.203: ATMEGA1280.46 74.48,21.22 74.6,21.11 82.09,21.11 v82.7,21.72
  Bottom 0.203: v82.7,21.72 82.7,47.47 COMMUNICATION.4
TXD2  (via drill 0.41)
  Top 0.203: ATMEGA1280.13 61.14,30.48 v60.35,30.46
  Bottom 0.203: v60.35,30.46 60.38,32.23 60.38,37.26 64.72,46.3 64.77,53.77 73.74,53.85 COMMUNICATION.6
TXD3  (via drill 0.41)
  Top 0.203: ATMEGA1280.64 80.51,30.98 v80.54,31.88 | SJ1.1 RX/TX_ATMEL.P$1 51.44,21.59 51.44,33.02 46.35,33.02 46.33,43.33 v44.45,43.33 | v44.45,55.65 44.48,56.97 v63.48,57 | v68.58,57.07 COMMUNICATION.8
  Bottom 0.203: COMMUNICATION.8 71.12,48.89 78.74,48.89 81.28,46.35 81.28,32.38 v80.54,31.88 | v44.45,43.33 v44.45,55.65 | v63.48,57 v68.58,57.07
TXD_IN
  Top 0.203: SJ1.2 TC7W125FU.5
VCC  (via drill 0.71)
  Top 0.203: ATMEGA1280.31 66.98,22.55
  Top 0.305: 64.31,32 ATMEGA1280.10 | 64.24,38.46 ATMEGA1280.100 | 76.38,29.49 ATMEGA1280.61 | 66.98,23.8 ATMEGA1280.31 | 66.98,22.55 67.01,20.86 66.04,19.69 | ATMEGA1280.80 74.48,37.27 74.93,36.83
  Top 0.457: 66.34,24.21 66.98,23.8
  Top 0.508: ICSP1.2 86.31,10.11 86.31,8.59 86.18,8.46 75.29,8.46 75.41,8.59 R9.1 74.14,8.89 55.24,8.89 54.86,9.53 54.79,19.68 54.8,19.69 66.04,19.69 | C5.1 65.41,45.72 v66.04,48.26 C6.1 | v77.47,44.45 77.47,44.13 C7.1 | 76.26,35.61 v76.53,35.53 75.23,36.83 74.93,36.83 | 64.31,32 64.24,38.46 | 75.74,28.7 76.38,29.49
  Top 0.813: 75.74,28.7 66.27,28.68 66.34,24.21
  Top 1.016: 74.93,32.03 75.74,28.7 | v76.53,35.53 74.93,32.03 | 74.93,32.03 64.31,32 | v40.64,55.24 44.5,58.19 52.76,58.19 55.35,58.62 66.04,58.62 | POWER1.3 38.1,5.31 38.08,5.56 23.75,5.51 23.75,6.83 23.72,7.06 23.8,8.31 29.31,8.33 v29.23,16.1 | v25.63,23.14 25.63,33.58 20.9,38.3 20.9,40.59 22.3,41.99 22.76,46.1 v23.34,48.79
  Top 1.676: v66.04,48.26 66.04,58.62 66.12,73.99 R6.1 R7.1 VCC_ATMEL_IN/OUT.1 SJ3.2
  Bottom 0.508: R8.2 40.64,43.81 v40.64,55.24
  Bottom 1.016: v29.23,16.1 27.71,16.1 27.3,16.51 27.3,16.54 24.54,19.3 24.54,22.05 v25.63,23.14 | v23.34,48.79 23.22,48.21 21.44,49.99 21.44,52.5 23.06,54.13 39.52,54.13 v40.64,55.24
  Bottom 1.27: v76.53,35.53 76.83,38.73 v77.47,44.45
  Bottom 1.676: v66.04,48.26 67.31,48.26 68.58,46.99 76.2,46.99 77.47,45.72 v77.47,44.45
VCC5V  (via drill 0.71)
  Top 1.016: v21.84,8.2 v21.92,11.58
  Top 1.27: v19.91,58.83 U1.VIN C3.1 32.16,64.39 C2.1 34.92,65.41 v38.1,70.48
  Bottom 1.016: v19.91,58.83 5.08,52.07 5.08,18.42 7.75,18.49 7.75,8.26 v21.84,8.2 | v21.92,11.58 37.47,11.63 37.47,5.71 45.72,5.71
  Bottom 1.27: VCC_INPUT.1 71.75,74.3 71.75,70.48 v38.1,70.48 | 45.72,5.71 POWER1.6
VCC/2  (via drill 0.71)
  Top 0.61: C1.POS 11.43,51.43 | 9.55,53.28 11.18,50.8
  Top 1.016: v7.37,51.36 9.55,53.28
  Top 1.422: GE863.27_VBATT 11.18,50.8 C1.POS SJ6.2
  Bottom 1.016: POWER1.2 35.61,9.96 10.26,9.93 10.16,19.05 10.16,20.96 7.37,20.88 v7.37,51.36

### Text on the board
tNames: ATMEL | JUMP | DTR | TELIT_ON/OFF | To columbia with love, FROM: | TELIT | GROUND LAB | HIGH | LOW | v.02 | JUMP | TELIT_ON/OFF | GPSNEMA | AREF | GND | PB7 | PB6 | PB5 | PB4 | PH6 | PH5 | PH4 | PH3 | PE3 | PG5 | PE5 | PE4 | PE1 | PE0 | TXD3 | RXD3 | TXD2 | RXD2 | TXD1 | RXD1 | SDA | SCL | RX | TX | PA0/1 | AGND | PA2/3 | PA4/5 | PA6/7 | PC7/6 | PC5/4 | PC3/2 | PC1/0 | GPS | PD7/PG2 | RXD | PG1/0 | PL7/6 | PL5/4 | PL3/2 | TXBIN | RXBIN | TXD | PL1/0 | 4 | 3 | PB2/3 | RXGPS | 2 | Telit_I/O | RESET | 1 | TXGPS | ADC0 | ADC1 | ADC2 | ADC3 | ADC4 | ADC5 | ADC6 | ADC7 | ADC8 | ADC9 | ADC10 | ADC11 | ADC12 | ADC13 | ADC14 | ADC15 | GSM
tValues: C1 | PB0/1